# Altium schematic sheet Servo control board.SchDoc
size A4
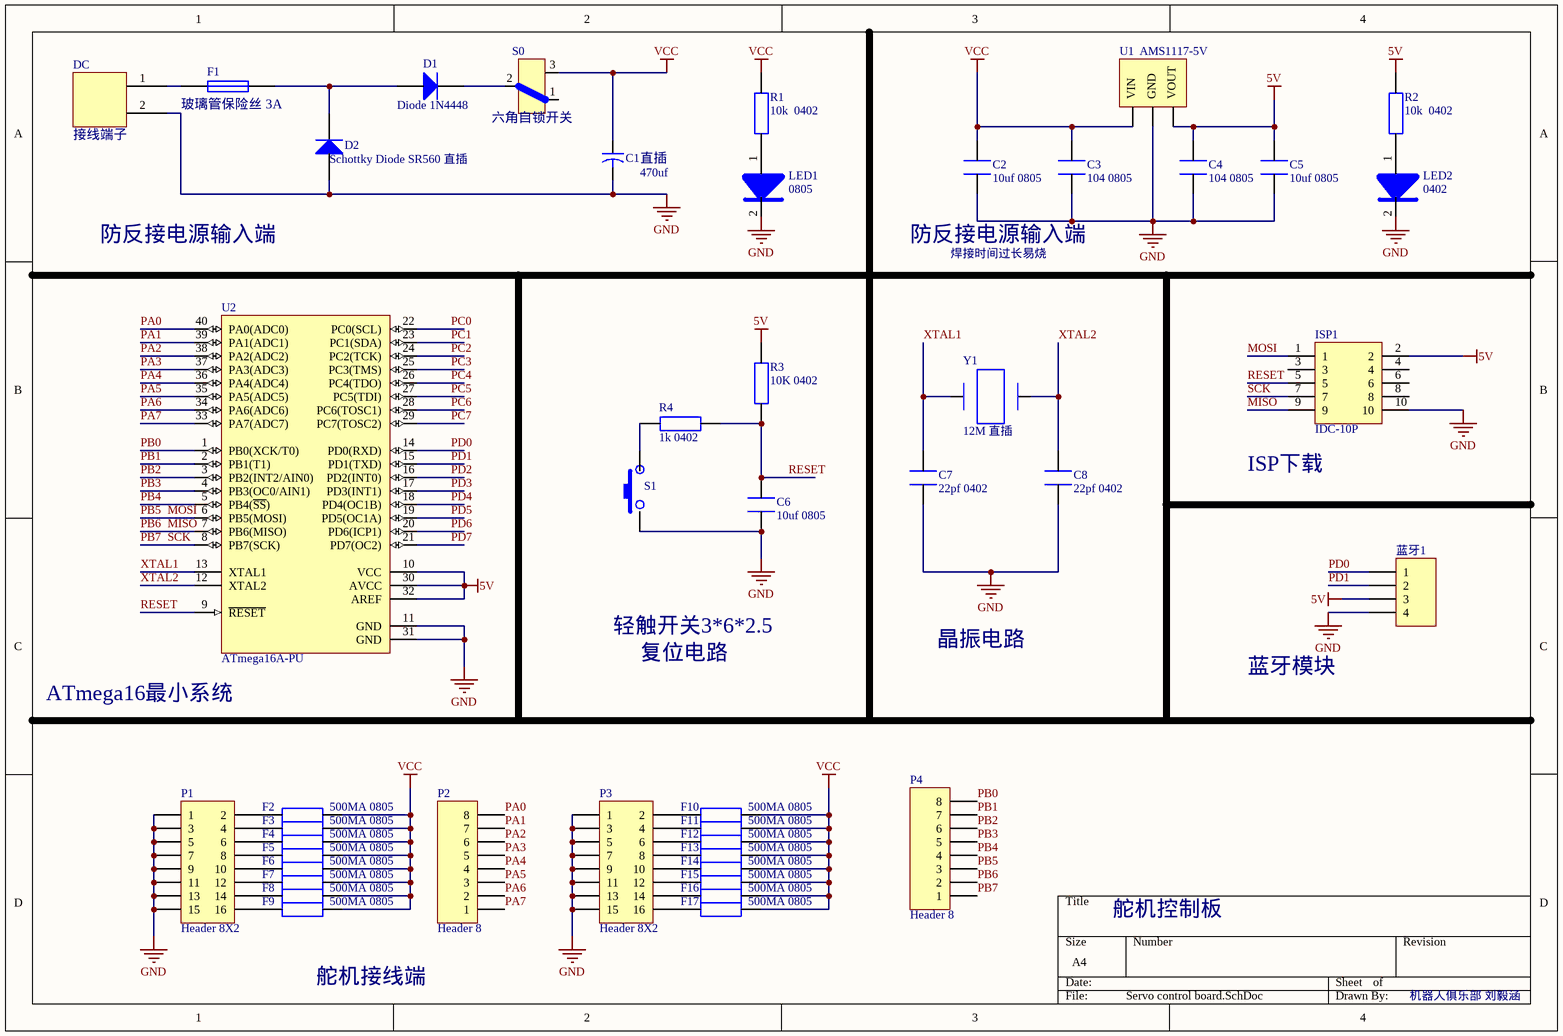
[diagram p0: Servo control board.SchDoc]

## Parts
C1  直插  value 470uf  [CAPR5-4X5]
C2  10uf 0805  [0805_C]
C3  104 0805  [0805_C]
C4  104 0805  [0805_C]
C5  10uf 0805  [0805_C]
C6  10uf 0805  [0805_C]
C7  22pf 0402  [0805_C]
C8  22pf 0402  [0805_C]
D1  Diode 1N4448  [DO-35]
D2  Schottky Diode SR560 直插  [DO-35]
DC  接线端子  [接线端子-仅空]
F1  玻璃管保险丝 3A  [PIN-W2/E2.8]
F2  500MA 0805  [0805_R]
F3  500MA 0805  [0805_R]
F4  500MA 0805  [0805_R]
F5  500MA 0805  [0805_R]
F6  500MA 0805  [0805_R]
F7  500MA 0805  [0805_R]
F8  500MA 0805  [0805_R]
F9  500MA 0805  [0805_R]
F10  500MA 0805  [0805_R]
F11  500MA 0805  [0805_R]
F12  500MA 0805  [0805_R]
F13  500MA 0805  [0805_R]
F14  500MA 0805  [0805_R]
F15  500MA 0805  [0805_R]
F16  500MA 0805  [0805_R]
F17  500MA 0805  [0805_R]
ISP1  IDC-10P  [IDC2.54-10P]
LED1  0805  [LED贴片]
LED2  0402  [LED贴片]
P1  Header 8X2  [HDR2X8]
P2  Header 8  [HDR1X8]
P3  Header 8X2  [HDR2X8]
P4  Header 8  [HDR1X8]
R1  10k  0402  [0805_R]
R2  10k  0402  [0805_R]
R3  10K 0402  [0805_R]
R4  1k 0402  [0805_R]
S0  六角自锁开关  [DPDT-6]
S1  轻触开关（3*6*2.5mm）  [轻触开关（3*6*2.5mm）]  (value not drawn)
U1  AMS1117-5V  [AMS1117]
U2  ATmega16A-PU  [40P6]
Y1  12M 直插  [晶振]
蓝牙1  Header 4  [HDR1X4]  (value not drawn)

## Nets
5V: C4.2 C5.2 ISP1.2 R2.2 R3.2 U1.3 U2.10(VCC) U2.30(AVCC) U2.32(AREF) 蓝牙1.3
GND: C1.2 C2.1 C3.1 C4.1 C5.1 C6.1 C7.1 C8.1 D2.1(A) DC.2 ISP1.10 LED1.2 LED2.2 P1.1 P1.3 P1.5 P1.7 P1.9 P1.11 P1.13 P1.15 P3.1 P3.3 P3.5 P3.7 P3.9 P3.11 P3.13 P3.15 S1.1 U1.2 U2.11(GND) U2.31(GND) 蓝牙1.4
VCC: C1.1 C2.2 C3.2 F2.2 F3.2 F4.2 F5.2 F6.2 F7.2 F8.2 F9.2 F10.2 F11.2 F12.2 F13.2 F14.2 F15.2 F16.2 F17.2 R1.2 S0.3 U1.1
MISO: ISP1.9 P4.2 U2.7(PB6(MISO))  [also labelled PB6]
MOSI: ISP1.1 P4.3 U2.6(PB5(MOSI))  [also labelled PB5]
PA0: P2.8 U2.40(PA0(ADC0))
PA1: P2.7 U2.39(PA1(ADC1))
PA2: P2.6 U2.38(PA2(ADC2))
PA3: P2.5 U2.37(PA3(ADC3))
PA4: P2.4 U2.36(PA4(ADC4))
PA5: P2.3 U2.35(PA5(ADC5))
PA6: P2.2 U2.34(PA6(ADC6))
PA7: P2.1 U2.33(PA7(ADC7))
PB0: P4.8 U2.1(PB0(XCK/T0))
PB1: P4.7 U2.2(PB1(T1))
PB2: P4.6 U2.3(PB2(INT2/AIN0))
PB3: P4.5 U2.4(PB3(OC0/AIN1))
PB4: P4.4 U2.5(PB4(~{SS}))
PB7: ISP1.7 P4.1 U2.8(PB7(SCK))  [also labelled SCK]
PC0: U2.22(PC0(SCL))
PC1: U2.23(PC1(SDA))
PC2: U2.24(PC2(TCK))
PC3: U2.25(PC3(TMS))
PC4: U2.26(PC4(TDO))
PC5: U2.27(PC5(TDI))
PC6: U2.28(PC6(TOSC1))
PC7: U2.29(PC7(TOSC2))
PD0: U2.14(PD0(RXD)) 蓝牙1.1
PD1: U2.15(PD1(TXD)) 蓝牙1.2
PD2: U2.16(PD2(INT0))
PD3: U2.17(PD3(INT1))
PD4: U2.18(PD4(OC1B))
PD5: U2.19(PD5(OC1A))
PD6: U2.20(PD6(ICP1))
PD7: U2.21(PD7(OC2))
RESET: C6.2 ISP1.5 R3.1 R4.2 U2.9(~{RESET})
XTAL1: C7.2 U2.13(XTAL1) Y1.2
XTAL2: C8.2 U2.12(XTAL2) Y1.1
NetD1_1: D1.1(A) D2.2(K) F1.2
NetD1_2: D1.2(K) S0.2
NetDC_1: DC.1 F1.1
NetF2_1: F2.1 P1.2
NetF3_1: F3.1 P1.4
NetF4_1: F4.1 P1.6
NetF5_1: F5.1 P1.8
NetF6_1: F6.1 P1.10
NetF7_1: F7.1 P1.12
NetF8_1: F8.1 P1.14
NetF9_1: F9.1 P1.16
NetF10_1: F10.1 P3.2
NetF11_1: F11.1 P3.4
NetF12_1: F12.1 P3.6
NetF13_1: F13.1 P3.8
NetF14_1: F14.1 P3.10
NetF15_1: F15.1 P3.12
NetF16_1: F16.1 P3.14
NetF17_1: F17.1 P3.16
NetLED1_1: LED1.1 R1.1
NetLED2_1: LED2.1 R2.1
NetR4_1: R4.1 S1.2

Not connected (* = marked no-connect by the designer): ISP1 3 4 6 8; S0 1 4 5 6

## Notes on the sheet
- 防反接电源输入端
- (near C2) 防反接电源输入端
- 焊接时间过长易烧
- (near ISP1) ISP下载
- 轻触开关3*6*2.5
- 晶振电路
- ATmega16最小系统
- 复位电路
- 蓝牙模块
- 舵机控制板
- 舵机接线端
- 机器人俱乐部 刘毅涵
- (in symbol AMS1117) VIN; GND; VOUT

## Library data of the parts
C1 = Cap2: Capacitor; Published: 23-Sep-2002; PackageReference: CAPR5-4X5; Publisher: Altium Limited; PackageDescription: Capacitor; 2 Leads
C2 C5 C6 = 0805 C_1
C3 C4 = 0805 C
C7 C8 = 0805 C_2
D1 = Diode 1N4448: High Conductance Fast Diode
D2 = Diode 1N4448_1: High Conductance Fast Diode
F1 = Fuse 1: Fuse; Published: 8-Jun-2000; LatestRevisionDate: 17-Jul-2002; LatestRevisionNote: Re-released for DXP Platform.; PackageReference: PIN-W2/E2.8; Publisher: Altium Limited; PackageDescription: Thru-Hole; 2 Leads
F2-F17 = 0805 R_2
LED1 LED2 = LED贴片
P1 P3 = Header 8X2: Header, 8-Pin, Dual row; LatestRevisionDate: 17-Jul-2002; LatestRevisionNote: Re-released for DXP Platform.; Publisher: Altium Limited
P2 P4 = Header 8: Header, 8-Pin; LatestRevisionDate: 17-Jul-2002; LatestRevisionNote: Re-released for DXP Platform.; Publisher: Altium Limited
R1 R2 = 0805 R
R3 R4 = 0805 R_1
S0 = 六脚自锁开关
U1 = AMS1117
U2 = ATmega16A-PU: 8-bit AVR Microcontroller, 16KB Flash, 512 Bytes EEPROM, 1KB SRAM, 40-pin PDIP, Industrial Grade (-40癈 to 85癈)
Y1 = 晶振
蓝牙1 = Header 4: Header, 4-Pin; LatestRevisionDate: 17-Jul-2002; LatestRevisionNote: Re-released for DXP Platform.; Publisher: Altium Limited